# Altium schematic sheet KNX-MCU-CONTROL_V0.2.SchDoc
size 297 x 209 mm
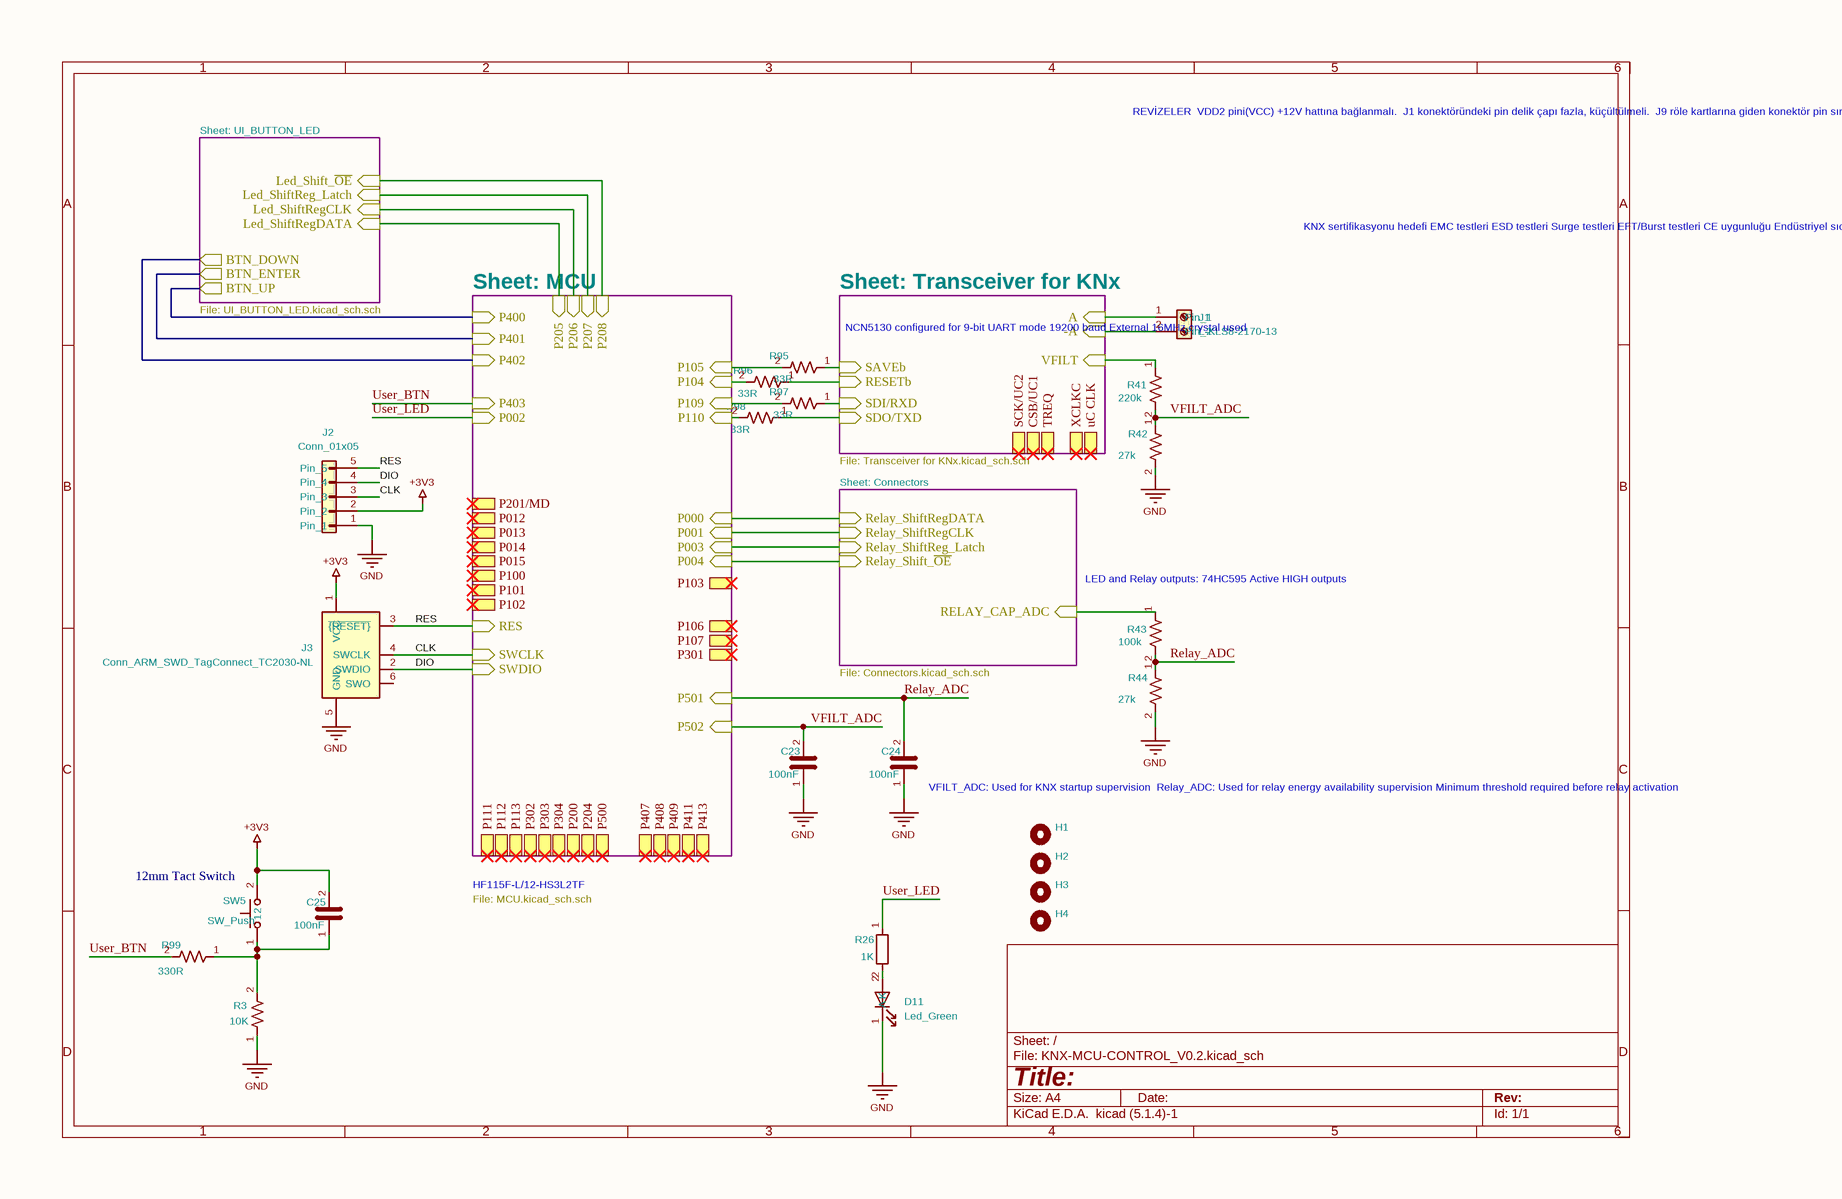
[diagram p0: KNX-MCU-CONTROL_V0.2.SchDoc]

## Parts
C23  100nF  [C_0603_1608Metric]
C24  100nF  [C_0603_1608Metric]
C25  100nF  [C_0603_1608Metric]
D11  Led_Green  [LED_D3.0mm]
H1  YP-1132-20-0-N-0  [MountingHole_3mm]  (value not drawn)
H2  YP-1132-20-0-N-0  [MountingHole_3mm]  (value not drawn)
H3  YP-1132-20-0-N-0  [MountingHole_3mm]  (value not drawn)
H4  YP-1132-20-0-N-0  [MountingHole_3mm]  (value not drawn)
J1  L-KLS8-2170-13  [Samtec_HPM-02-01-x-S_Straight_1x02_Pitch5.08mm]
J2  Conn_01x05  [PinHeader_1x05_P2.54mm_Vertical]  (no BOM)
J3  Conn_ARM_SWD_TagConnect_TC2030-NL  [Tag-Connect_TC2030-IDC-NL_2x03_P1.27mm_Vertical]  (no BOM)
R3  10K  [R_0603_1608Metric]
R26  1K  [R_0603_1608Metric]
R41  220k  [R_0603_1608Metric]
R42  27k  [R_0603_1608Metric]
R43  100k  [R_0603_1608Metric]
R44  27k  [R_0603_1608Metric]
R95  33R  [R_0603_1608Metric]
R96  33R  [R_0603_1608Metric]
R97  33R  [R_0603_1608Metric]
R98  33R  [R_0603_1608Metric]
R99  330R  [R_0603_1608Metric]
SW5  SW_Push  [SW_SPST_Omron_B3FS-100xP]

## Sub-sheets
Connectors = Connectors.SchDoc: RELAY_CAP_ADC (in), Relay_ShiftRegCLK (in), Relay_ShiftRegDATA (in), Relay_Shift_~{OE} (in), Relay_ShiftReg_Latch (in)
MCU = MCU.SchDoc: P000 (in), P001 (in), P003 (in), P104 (in), P105 (in), P109 (in), P110 (in), P400 (in), P401 (in), P402 (in), P501 (in), RES (in), SWCLK (in), SWDIO (in), P004 (in), P205 (in), P206 (in), P207 (in), P208 (in), P403 (in), P002 (in), P502 (in), P012, P013, P014, P015, P100, P101, P102, P103, P106, P107, P301, P111, P112, P113, P302, P303, P304, P200, P204, P500, P407, P408, P409, P411, P413, P201/MD
Transceiver for KNx = Transceiver for KNx.SchDoc: RESETb (in), SAVEb (in), SDI/RXD (in), SDO/TXD (in), VFILT (in), A (in), -A (in), SCK/UC2, CSB/UC1, TREQ, XCLKC, uC CLK
UI_BUTTON_LED = UI_BUTTON_LED.SchDoc: BTN_DOWN (out), BTN_ENTER (out), BTN_UP (out), Led_ShiftRegCLK (in), Led_ShiftRegDATA (in), Led_ShiftReg_Latch (in), Led_Shift_~{OE} (in)

## Nets
+3V3: C25.2 J2.2(Pin_2) J3.1(VCC) SW5.2
GND: C23.1 C24.1 D11.1(K) J2.1(Pin_1) J3.5(GND) R3.1 R42.2 R44.2
CLK: J2.3(Pin_3) J3.4(SWCLK) ; sheet MCU/SWCLK
DIO: J2.4(Pin_4) J3.2(SWDIO) ; sheet MCU/SWDIO
Relay_ADC: C24.2 R43.2 R44.1 ; sheet MCU/P501
RES: J2.5(Pin_5) J3.3(~{{RESET}}) ; sheet MCU/RES
User_BTN: R99.2 ; sheet MCU/P403
User_LED: R26.1 ; sheet MCU/P002
VFILT_ADC: C23.2 R41.2 R42.1 ; sheet MCU/P502
NetC25_1: C25.1 R3.2 R99.1 SW5.1
NetD11_2: D11.2(A) R26.2
NetJ1_1: J1.1(Pin_1) ; sheet Transceiver for KNx/A
NetJ1_2: J1.2(Pin_2) ; sheet Transceiver for KNx/-A
NetR41_1: R41.1 ; sheet Transceiver for KNx/VFILT
NetR43_1: R43.1 ; sheet Connectors/RELAY_CAP_ADC
NetR95_1: R95.1 ; sheet Transceiver for KNx/SAVEb
NetR95_2: R95.2 ; sheet MCU/P105
NetR96_1: R96.1 ; sheet Transceiver for KNx/RESETb
NetR96_2: R96.2 ; sheet MCU/P104
NetR97_1: R97.1 ; sheet Transceiver for KNx/SDI/RXD
NetR97_2: R97.2 ; sheet MCU/P109
NetR98_1: R98.1 ; sheet Transceiver for KNx/SDO/TXD
NetR98_2: R98.2 ; sheet MCU/P110
(unnamed): sheet Connectors/Relay_ShiftRegCLK, sheet MCU/P001
(unnamed): sheet Connectors/Relay_ShiftRegDATA, sheet MCU/P000
(unnamed): sheet Connectors/Relay_Shift_~{OE}, sheet MCU/P004
(unnamed): sheet Connectors/Relay_ShiftReg_Latch, sheet MCU/P003
(unnamed): sheet MCU/P400, sheet UI_BUTTON_LED/BTN_UP
(unnamed): sheet MCU/P401, sheet UI_BUTTON_LED/BTN_ENTER
(unnamed): sheet MCU/P402, sheet UI_BUTTON_LED/BTN_DOWN
(unnamed): sheet MCU/P205, sheet UI_BUTTON_LED/Led_ShiftRegDATA
(unnamed): sheet MCU/P206, sheet UI_BUTTON_LED/Led_ShiftRegCLK
(unnamed): sheet MCU/P207, sheet UI_BUTTON_LED/Led_ShiftReg_Latch
(unnamed): sheet MCU/P208, sheet UI_BUTTON_LED/Led_Shift_~{OE}

Not connected (* = marked no-connect by the designer): J3 6(SWO)

## Notes on the sheet
- Sheet: UI_BUTTON_LED
- REVİZELER
  VDD2 pini(VCC) +12V hattına bağlanmalı.
  J1 konektöründeki pin delik çapı fazla, küçültülmeli.
  J9 röle kartlarına giden konektör pin sırası uyuşmuyor kontrol edilmeli.
  VFILT_ADC P500 den P502 ye bağlanmalı.
  16ch da kapasitör yetmiyor artırmak gerekli
  24ch da kapasitör bankası SMD kılıfı var mı bi bak.
- KNX sertifikasyonu hedefi
  EMC testleri
  ESD testleri
  Surge testleri
  EFT/Burst testleri
  CE uygunluğu
  Endüstriyel sıcaklık aralığı
  Uzun süreli saha kullanımı
  Fan-in akımı 20-40mA sınıfı düşünülüyor
  PCB'de geniş GND poligonları ve düşük EMI hedefleniyor
- File: UI_BUTTON_LED.kicad_sch.sch
- Sheet: MCU
- Sheet: Transceiver for KNx
- (near J1) NCN5130 configured for 9-bit UART mode
  19200 baud
  External 16MHz crystal used
- File: Transceiver for KNx.kicad_sch.sch
- Sheet: Connectors
- (near R43) LED and Relay outputs:
  74HC595
  Active HIGH outputs
- File: Connectors.kicad_sch.sch
- VFILT_ADC:
  Used for KNX startup supervision
  Relay_ADC:
  Used for relay energy availability supervision
  Minimum threshold required before relay activation
- (near SW5) 12mm Tact Switch
- File: MCU.kicad_sch.sch
- HF115F-L/12-HS3L2TF
- 1
- 2
- 3
- 4
- 5
- 6
- A
- B
- C
- D
- Title:
- File: KNX-MCU-CONTROL_V0.2.kicad_sch
- Sheet: /
- KiCad E.D.A.  kicad (5.1.4)-1
- Size: A4
- Date:
- Rev:
- Id: 1/1

## Library data of the parts
C23 C24 = C_1: Manufacturer Part Number: CL10B104KB8NNNC; Manufacturer: Samsung Electro-Mechanics; Package: C_0603; Value: 100nF; Footprint: Capacitor_SMD:C_0603_1608Metric
C25 = C_3: Manufacturer Part Number: CC0603KRX7R9BB104; Manufacturer: YAGEO; Package: C_0603; Value: 100nF; Footprint: Capacitor_SMD:C_0603_1608Metric
D11 = LED: Manufacturer Part Number: TZ-L2-03YYBYG1GDJ30-001; Manufacturer: TUOZHAN; Package: Through Hole,D=3mm; Value: Led_Green; Footprint: LED_THT:LED_D3.0mm
H1-H4 = MountingHole: YP-1132 Geçmeli Yükseltme Parçası (3.2mm delik için) İki Tarafı Kilitli; Manufacturer: Altınkaya; Value: MountingHole; Footprint: MountingHole:MountingHole_3mm; Manufacturer Part Number: YP-1132-20-0-N-0
J1 = Screw_Terminal_01x02: Manufacturer: KLS ELECTRONIC; Manufacturer Part Number: L-KLS8-2170-13; Package: THT V/T; Value: L-KLS8-2170-13; Footprint: Connector_Samtec_HPM_THT:Samtec_HPM-02-01-x-S_Straight_1x02_Pitch5.08mm
R3 = R_US: Manufacturer Part Number: FRC0603J103TS; Manufacturer: FOJAN; Package: R_0603; Value: 10K; Footprint: Resistor_SMD:R_0603_1608Metric
R26 = R_7: Manufacturer Part Number: SCR0603J1K; Manufacturer: VO; Package: R0603; Value: 1K; Footprint: Resistor_SMD:R_0603_1608Metric
R41 = R_US: Manufacturer Part Number: ERJ3EKF2203V; Manufacturer: PANASONIC; Package: R_0603; Value: 220k; Footprint: Resistor_SMD:R_0603_1608Metric
R42 R44 = R_US: Manufacturer Part Number: ERJ3EKF2702V; Manufacturer: PANASONIC; Package: R_0603; Value: 27k; Footprint: Resistor_SMD:R_0603_1608Metric
R43 = R_US: Manufacturer Part Number: RC0603FR-07100KL; Manufacturer: YAGEO; Package: R_0603; Value: 100k; Footprint: Resistor_SMD:R_0603_1608Metric
R95-R98 = R_US: Manufacturer Part Number: 0603SAF330JT5E; Manufacturer: ROYALOHM; Package: R_0603; Value: 33R; Footprint: Resistor_SMD:R_0603_1608Metric
R99 = R_US: Manufacturer Part Number: FRC0603J331 TS; Manufacturer: FOJAN; Package: R_0603; Value: 330R; Footprint: Resistor_SMD:R_0603_1608Metric
SW5 = SW_Push: Manufacturer Part Number: KH-12X12X8H-SMT; Manufacturer: kinghelm; Package: SMD,12x12mm; Value: SW_Push; Footprint: Button_Switch_SMD:SW_SPST_Omron_B3FS-100xP
J2 = Conn_01x05: Value: Conn_01x05; Footprint: Connector_PinHeader_2.54mm:PinHeader_1x05_P2.54mm_Vertical
J3 = Conn_ARM_SWD_TagConnect_TC2030-NL: Value: Conn_ARM_SWD_TagConnect_TC2030-NL; Footprint: Connector:Tag-Connect_TC2030-IDC-NL_2x03_P1.27mm_Vertical